# EAGLE design EtchAsketch (EAGLE 9.7.0)
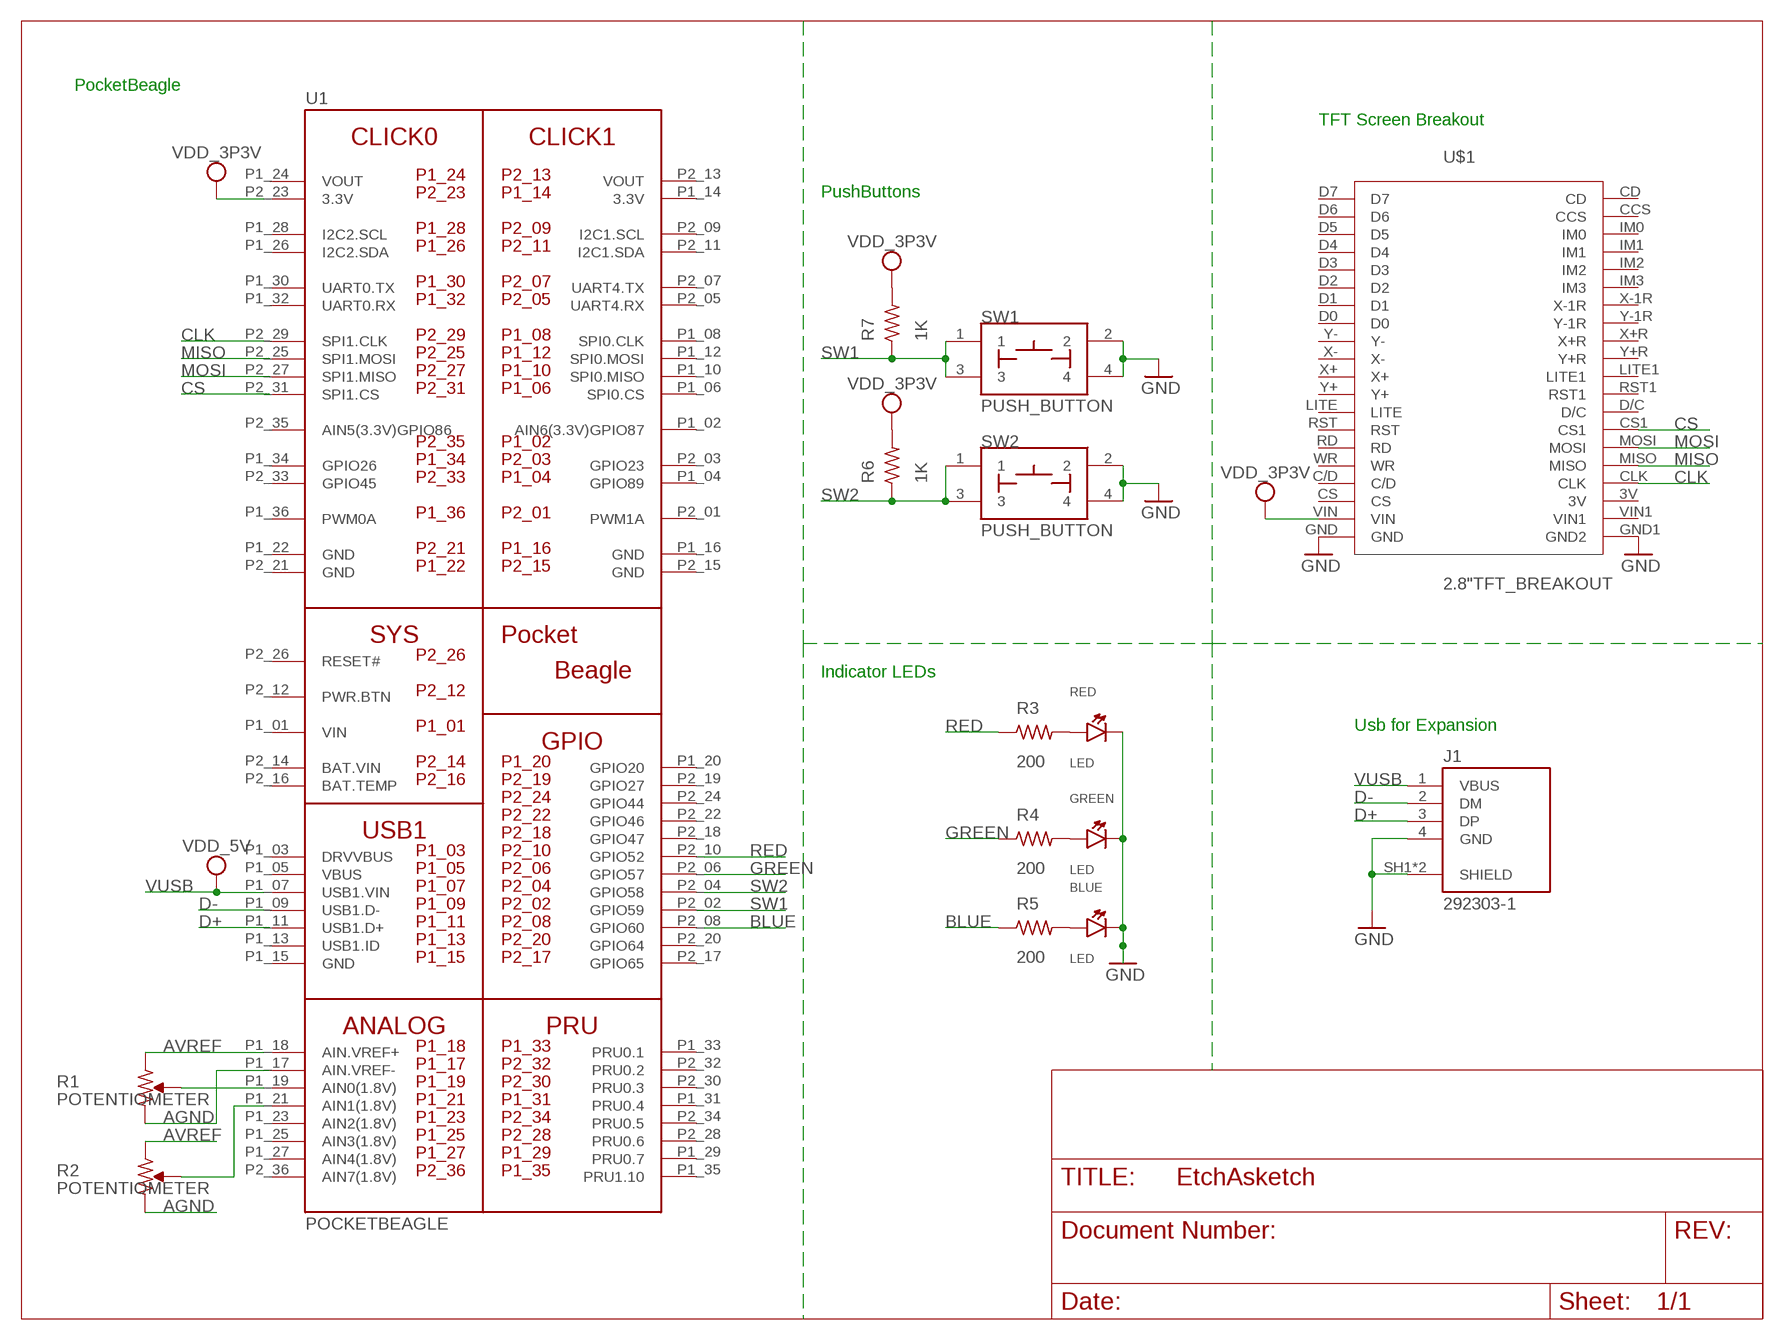
[diagram p0: schematic, sheet 1]

## Parts
BLUE  LED  [EIA-STD]
GREEN  LED  [EIA-STD]
J1  292303-1  [TE_292303-1]
R1  POTENTIOMETER  [POT-PO90S]
R2  POTENTIOMETER  [POT-PO90S]
R3  200  R_R0402  [R0402]
R4  200  R_R0402  [R0402]
R5  200  R_R0402  [R0402]
R6  1K  R_R0402  [R0402]
R7  1K  R_R0402  [R0402]
RED  LED  [EIA-STD]
SW1  PUSH_BUTTON  [BUTTON_12.5MM]
SW2  PUSH_BUTTON  [BUTTON_12.5MM]
U1  POCKETBEAGLE  [POCKETBEAGLE]
U$1  2.8"TFT_BREAKOUT  [2.8"TFTBRTEAKOUT]

## Nets
AGND: R1.CW R2.CW U1.P1_17(AIN.VREF-)
AVREF: R1.CCW R2.CCW U1.P1_18(AIN.VREF+)
BLUE: R5.1 U1.P2_08(GPIO60)
CLK: U1.P2_29(SPI1.CLK) U$1.CLK
CS: U1.P2_31(SPI1.CS) U$1.CS1
D+: J1.3(DP) U1.P1_11(USB1.D+)
D-: J1.2(DM) U1.P1_09(USB1.D-)
GND: BLUE.CATHODE GREEN.CATHODE J1.4(GND) J1.SH1(SHIELD) J1.SH2(SHIELD) RED.CATHODE SW1.2 SW1.4 SW2.2 SW2.4 U$1.GND U$1.GND1(GND2)
GREEN: R4.1 U1.P2_06(GPIO57)
MISO: U1.P2_25(SPI1.MOSI) U$1.MISO
MOSI: U1.P2_27(SPI1.MISO) U$1.MOSI
N$1: R3.2 RED.ANODE
N$2: R1.S U1.P1_19(AIN0(1.8V))
N$3: GREEN.ANODE R4.2
N$4: BLUE.ANODE R5.2
N$6: R2.S U1.P1_21(AIN1(1.8V))
RED: R3.1 U1.P2_10(GPIO52)
SW1: R7.1 SW1.1 SW1.3 U1.P2_02(GPIO59)
SW2: R6.1 SW2.1 SW2.3 U1.P2_04(GPIO58)
VDD_3P3V: R6.2 R7.2 U1.P2_23(3.3V) U$1.VIN
VUSB: J1.1(VBUS) U1.P1_07(USB1.VIN) ; supply symbol labelled VDD_5V
Unconnected: U1.P1_02(AIN6(3.3V)GPIO87) U1.P1_03(DRVVBUS) U1.P1_04(GPIO89) U1.P1_05(VBUS) U1.P1_06(SPI0.CS) U1.P1_08(SPI0.CLK) U1.P1_10(SPI0.MISO) U1.P1_12(SPI0.MOSI) U1.P1_13(USB1.ID) U1.P1_15(GND) U1.P1_20(GPIO20) U1.P1_23(AIN2(1.8V)) U1.P1_25(AIN3(1.8V)) U1.P1_26(I2C2.SDA) U1.P1_27(AIN4(1.8V)) U1.P1_28(I2C2.SCL) U1.P1_29(PRU0.7) U1.P1_30(UART0.TX) U1.P1_31(PRU0.4) U1.P1_32(UART0.RX) U1.P1_33(PRU0.1) U1.P1_34(GPIO26) U1.P1_35(PRU1.10) U1.P1_36(PWM0A) U1.P2_01(PWM1A) U1.P2_03(GPIO23) U1.P2_05(UART4.RX) U1.P2_07(UART4.TX) U1.P2_09(I2C1.SCL) U1.P2_11(I2C1.SDA) U1.P2_12(PWR.BTN) U1.P2_16(BAT.TEMP) U1.P2_17(GPIO65) U1.P2_18(GPIO47) U1.P2_19(GPIO27) U1.P2_20(GPIO64) U1.P2_22(GPIO46) U1.P2_24(GPIO44) U1.P2_26(RESET#) U1.P2_28(PRU0.6) U1.P2_30(PRU0.3) U1.P2_32(PRU0.2) U1.P2_33(GPIO45) U1.P2_34(PRU0.5) U1.P2_35(AIN5(3.3V)GPIO86) U1.P2_36(AIN7(1.8V)) U$1.3V U$1.C/D U$1.CCS U$1.CD U$1.CS U$1.D0 U$1.D1 U$1.D2 U$1.D3 U$1.D4 U$1.D5 U$1.D6 U$1.D7 U$1.D/C U$1.IM0 U$1.IM1 U$1.IM2 U$1.IM3 U$1.LITE U$1.LITE1 U$1.RD U$1.RST U$1.RST1 U$1.VIN1 U$1.WR U$1.X+ U$1.X+R U$1.X- U$1.X-1R U$1.Y+ U$1.Y+R U$1.Y- U$1.Y-1R

## Notes on the sheet
- PocketBeagle
- TFT Screen Breakout
- PushButtons
- Indicator LEDs
- Usb for Expansion

## Power pins joined to a net without a drawn wire
3.3V: U1.P1_14(3.3V)
BAT.VIN: U1.P2_14(BAT.VIN)
GND: U1.P1_16(GND) U1.P1_22(GND) U1.P2_15(GND) U1.P2_21(GND)
VIN: U1.P1_01(VIN)
VOUT: U1.P1_24(VOUT) U1.P2_13(VOUT)

## Library data of the parts
BLUE GREEN RED = EtchASketch:LED: EIA-STD LED, LTST-C191TBKT
J1 = EtchASketch:292303-1: CONN USB RECEPT R/A TYPE A 4POS Check availability <https://pricing.snapeda.com/parts/292303-1/TE%20Connectivity/view-part?ref=eda>; AVAILABILITY: In Stock; CENTERLINE_PITCH: 2 mm[.078 in]; COMMENT: 292303-1; DESCRIPTION: Conn; Data; USB; Recept; 2.0; 4 Pos; 1 Port; Rt Angle; A Ser; Tin over Copper; EU_ROHS_COMPLIANCE: Compliant; MF: TE Connectivity; MP: 292303-1; NUMBER_OF_POSITIONS: 4; PACKAGE: None; PRICE: None; PRODUCT_TYPE: Connector; PURCHASE-URL: https://pricing.snapeda.com/search/part/292303-1/?ref=eda
R1 R2 = EtchASketch:POTENTIOMETER: Potentiometer - Examples: P090S-14T20BR10K (987-1277-ND)
R3-R7 = EtchASketch:R_: RESISTOR, American symbol
SW1 SW2 = EtchASketch:PUSH_BUTTON
U1 = combo_lock:POCKETBEAGLE
U$1 = EtchASketch:2.8"TFT_BREAKOUT

## Board
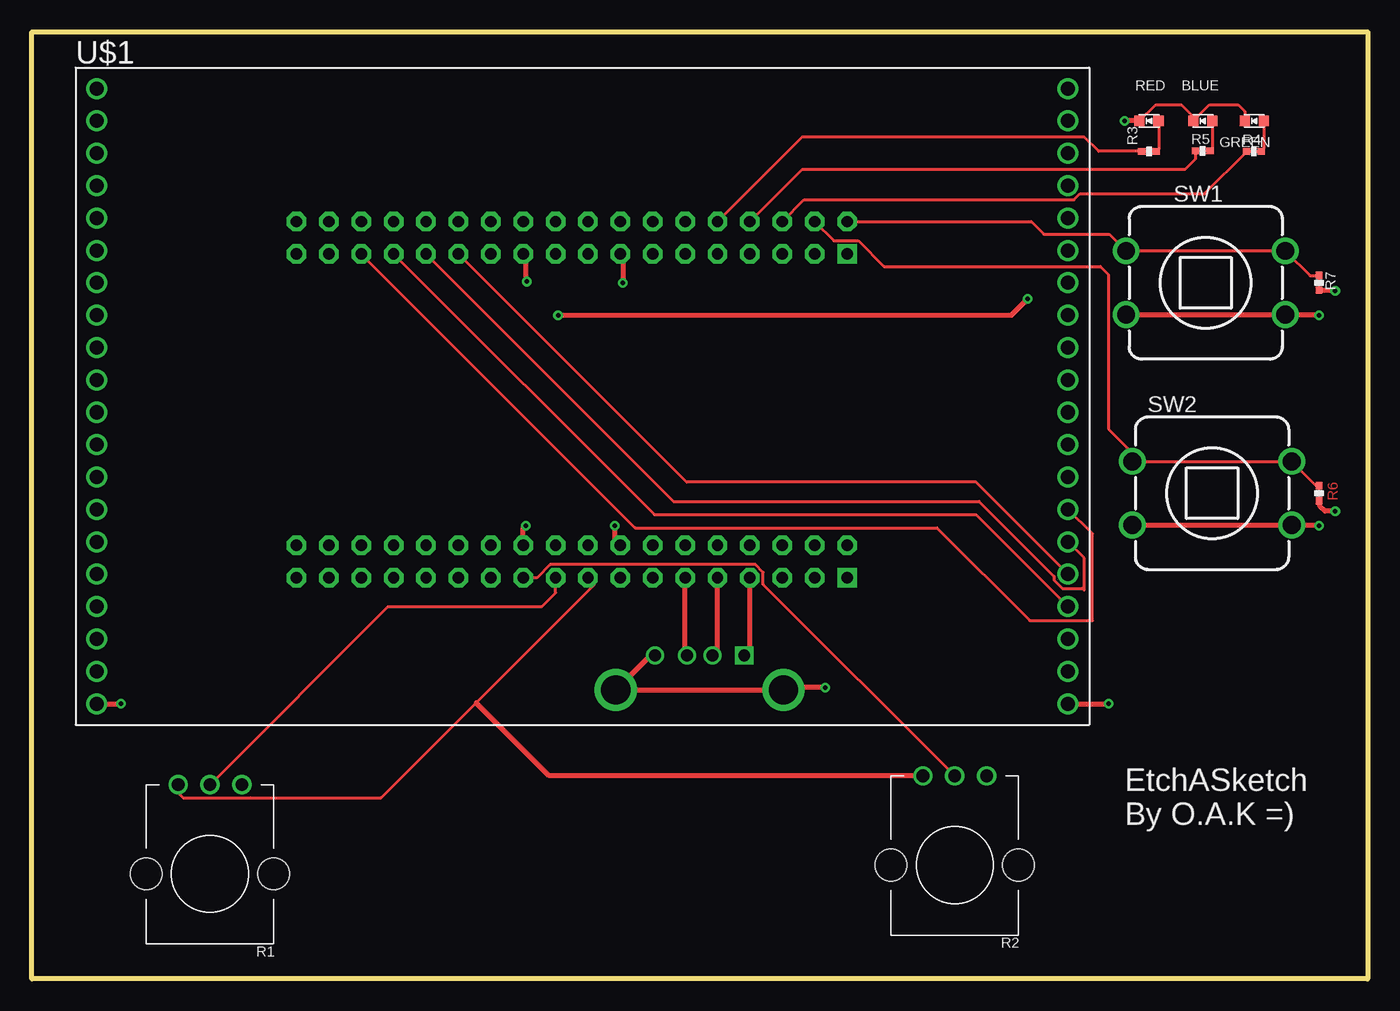
[diagram p1: board, top side]
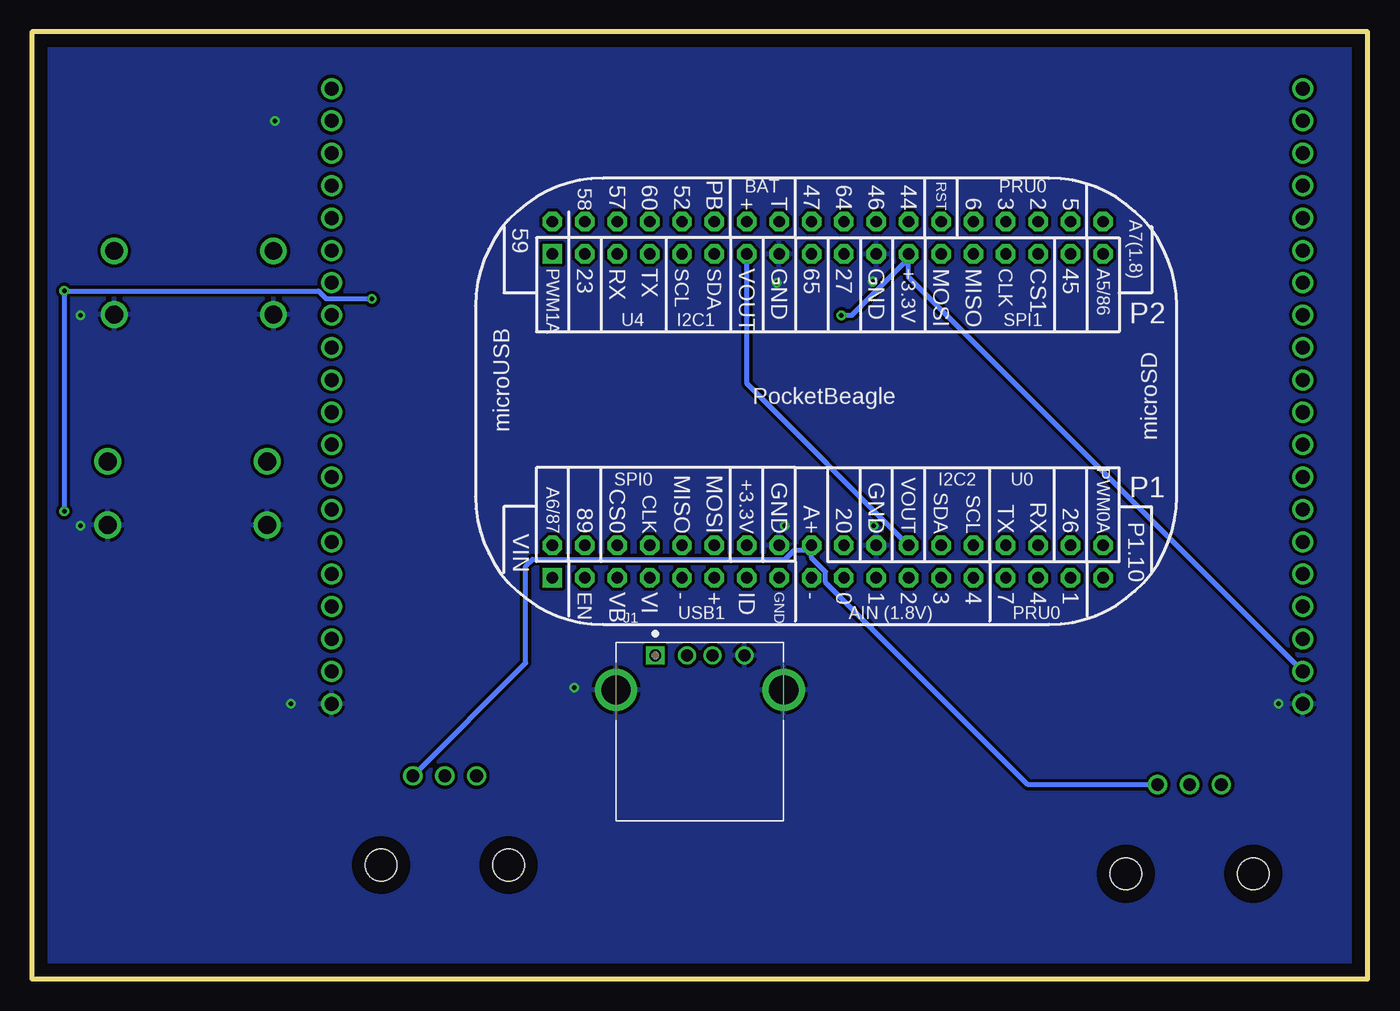
[diagram p2: board, bottom side, seen from below]

Size 104.78 x 74.3 mm. Coordinates in mm from the lower left corner, seen from the top.
Outline: 0,74.3 104.78,74.3 104.78,0 0,0 0,74.3
Copper layers (1*16): Top 0.035mm / dielectric 1.5mm / Bottom 0.035mm
Design rules "Fusion Electronics Design Rules": minimum track width 6mil, minimum drill 0.35mm, track to track 6mil, track to pad 6mil, pad to pad 6mil, via to via 6mil, smd to smd 6mil, copper to edge 40mil, drill to drill 6mil, minimum pad ring 10mil, minimum via ring 8mil, stop-mask expansion 4mil, vias tented up to drill 0mil, thermal gap 10mil

### Footprints (pad centres in the part's own frame; a part is rotated, then mirrored left to right if it is on the bottom)
EIA-STD = smd 0.8 x 0.8: ANODE -0.75,0; CATHODE 0.75,0
TE_292303-1 = drill 0.92 square: 1 0,0 | drill 0.92: 2 2.5,0; 3 4.5,0; 4 7,0 | drill 2.3: SH1 -3.07,-2.71; SH2 10.07,-2.71
POT-PO90S = drill 1: CCW -2.5,0; CW 2.5,0; S 0,0 | hole 2.5: -5,7; 5,7
R0402 = smd 0.61 x 0.508: 1 -0.559,0; 2 0.559,0
BUTTON_12.5MM = drill 1.4: 1 -6.25,2.5; 2 -6.25,-2.5; 3 6.25,2.5; 4 6.25,-2.5
POCKETBEAGLE = drill 0.889 pad 1.524 square: P1_01 5.91,3.53; P2_01 5.91,28.93 | drill 0.889 pad 1.524 octagon: P1_02 5.91,6.07; P1_03 8.45,3.53; P1_04 8.45,6.07; P1_05 10.99,3.53; P1_06 10.99,6.07; P1_07 13.53,3.53; P1_08 13.53,6.07; P1_09 16.07,3.53; P1_10 16.07,6.07; P1_11 18.61,3.53; P1_12 18.61,6.07; P1_13 21.15,3.53; P1_14 21.15,6.07; P1_15 23.69,3.53; P1_16 23.69,6.07; P1_17 26.23,3.53; P1_18 26.23,6.07; P1_19 28.77,3.53; P1_20 28.77,6.07; P1_21 31.31,3.53; P1_22 31.31,6.07; P1_23 33.85,3.53; P1_24 33.85,6.07; P1_25 36.39,3.53; P1_26 36.39,6.07; P1_27 38.93,3.53; P1_28 38.93,6.07; P1_29 41.47,3.53; P1_30 41.47,6.07; P1_31 44.01,3.53; P1_32 44.01,6.07; P1_33 46.55,3.53; P1_34 46.55,6.07; P1_35 49.09,3.53; P1_36 49.09,6.07; P2_02 5.91,31.47; P2_03 8.45,28.93; P2_04 8.45,31.47; P2_05 10.99,28.93; P2_06 10.99,31.47; P2_07 13.53,28.93; P2_08 13.53,31.47; P2_09 16.07,28.93; P2_10 16.07,31.47; P2_11 18.61,28.93; P2_12 18.61,31.47; P2_13 21.15,28.93; P2_14 21.15,31.47; P2_15 23.69,28.93; P2_16 23.69,31.47; P2_17 26.23,28.93; P2_18 26.23,31.47; P2_19 28.77,28.93; P2_20 28.77,31.47; P2_21 31.31,28.93; P2_22 31.31,31.47; P2_23 33.85,28.93; P2_24 33.85,31.47; P2_25 36.39,28.93; P2_26 36.39,31.47; P2_27 38.93,28.93; P2_28 38.93,31.47; P2_29 41.47,28.93; P2_30 41.47,31.47; P2_31 44.01,28.93; P2_32 44.01,31.47; P2_33 46.55,28.93; P2_34 46.55,31.47; P2_35 49.09,28.93; P2_36 49.09,31.47
2.8"TFTBRTEAKOUT = drill 1.1: 3V 78.74,-44.45; C/D 2.54,-41.91; CCS 78.74,-3.81; CD 78.74,-1.27; CLK 78.74,-41.91; CS 2.54,-44.45; CS1 78.74,-34.29; D0 2.54,-19.05; D1 2.54,-16.51; D2 2.54,-13.97; D3 2.54,-11.43; D4 2.54,-8.89; D5 2.54,-6.35; D6 2.54,-3.81; D7 2.54,-1.27; D/C 78.74,-31.75; GND 2.54,-49.53; GND1 78.74,-49.53; IM0 78.74,-6.35; IM1 78.74,-8.89; IM2 78.74,-11.43; IM3 78.74,-13.97; LITE 2.54,-31.75; LITE1 78.74,-26.67; MISO 78.74,-39.37; MOSI 78.74,-36.83; RD 2.54,-36.83; RST 2.54,-34.29; RST1 78.74,-29.21; VIN 2.54,-46.99; VIN1 78.74,-46.99; WR 2.54,-39.37; X+ 2.54,-29.21; X+R 78.74,-21.59; X- 2.54,-24.13; X-1R 78.74,-16.51; Y+ 2.54,-26.67; Y+R 78.74,-24.13; Y- 2.54,-21.59; Y-1R 78.74,-19.05

### Placement (x,y rotation side)
BLUE  91.85,67.31 180 top
GREEN  95.88,67.31 180 top
J1  55.88,25.38 0 bottom
R1  13.97,15.24 180 top
R2  72.39,15.93 180 top
R3  87.63,64.92 0 top
R4  95.85,64.91 0 top
R5  91.83,64.95 0 top
R6  100.97,38.1 270 top
R7  100.97,54.61 270 top
RED  87.63,67.31 180 top
SW1  92.07,54.61 0 top
SW2  92.57,38.1 0 top
U1  69.85,27.94 0 bottom
U$1  2.54,71.12 0 top

### Tracks (layer width: path | path; a pad name or v marks a point on that pad's centre or on a via)
AGND
  Top 0.254: U1.P1_17 44.13,30.96 34.84,21.67 27.38,14.21 17.15,14.21 11.87,14.21 11.47,14.6 R1.CW
  Top 0.381: R2.CW 40.58,15.93 34.84,21.67
AVREF
  Top 0.254: 43.62,33.46 U1.P1_18
  Bottom 0.381: R1.CCW 26.64,15.24 42.52,31.11 42.52,31.93 43.62,33.03 43.62,33.66 | 43.62,33.66 U1.P1_18 | R2.CCW 66.04,24.78 66.04,32.39 65.52,32.91 45.7,32.91 44.95,33.66 43.62,33.66
BLUE
  Top 0.254: U1.P2_08 60.41,63.5 90.45,63.5 91.27,64.32 R5.1 91.27,64.94
CLK
  Top 0.254: U$1.CLK 74.07,36.42 48.83,36.42 U1.P2_29
CS
  Top 0.254: U$1.CS1 83.19,34.92 83.19,28.11 78.28,28.11 71.01,35.38 47.33,35.38 U1.P2_31
D+
  Top 0.381: U1.P1_11 51.24,25.38 J1.3
D-
  Top 0.381: U1.P1_09 53.78,25.38 J1.2
GND  (via drill 0.35 pad 0.61)
  Top 0.254: RED.CATHODE 88.15,68.58 90.17,68.58 91.1,67.65 BLUE.CATHODE 92.37,68.58 94.62,68.58 95.13,68.06 GREEN.CATHODE
  Top 0.381: J1.4 48.52,25.38 J1.SH2 J1.SH1 59.14,22.86 v62.23,22.86 | U$1.GND1 v84.46,21.59 | SW2.2 SW2.4 100.93,35.6 v100.97,35.56 | SW1.2 SW1.4 100.93,52.11 v100.97,52.07 | RED.CATHODE v85.72,67.31 | U1.P2_21 38.74,56.67 38.74,54.8 v38.83,54.7 | U1.P2_15 46.35,56.67 v46.35,54.61 | U1.P1_16 45.72,34.45 v45.72,35.56 | U1.P1_22 38.54,35.36 v38.74,35.56 | U$1.GND v6.98,21.59
  pour Bottom (isolate 0.254): -2.35,76.64 -2.35,76.39 -1.87,76.39 -1.8,76.36 -1.74,76.31 -1.71,76.24 -1.71,-4.89 112.84,-4.89 112.84,76.64
GREEN
  Top 0.254: U1.P2_06 60.58,61.13 81.74,61.13 82.21,61.59 91.97,61.59 R4.1
MISO
  Top 0.254: U$1.MISO 74.07,38.96 51.37,38.96 U1.P2_25
MOSI
  Top 0.254: 80.65,34.29 U$1.MOSI 82.55,33.02 82.55,30.48 82.38,30.65 80.82,30.65 80.18,31.29 80.18,31.58 74.29,37.47 50.32,37.47 U1.P2_27
N$1
  Top 0.254: RED.ANODE 88.38,65.11 R3.2
N$2
  Top 0.254: R1.S 27.94,29.21 40.01,29.21 41.08,30.29 U1.P1_19
N$3
  Top 0.254: GREEN.ANODE 96.63,65.14 R4.2
N$4
  Top 0.254: BLUE.ANODE 92.6,65.17 R5.2
N$6
  Top 0.254: R2.S 57.36,30.96 57.36,31.9 56.75,32.51 40.65,32.51 39.61,31.47 U1.P1_21
RED
  Top 0.254: R3.1 83.67,64.92 82.55,66.04 60.41,66.04 U1.P2_10
SW1
  Top 0.254: R7.1 100.27,55.17 SW1.3 SW1.1 84.52,58.42 79.38,58.42 78.38,59.41 U1.P2_02
SW2
  Top 0.254: SW2.1 87,40.6 | 87,40.6 SW2.3 100.76,38.66 R6.1 | U1.P2_04 62.9,57.91 64.82,57.91 66.85,55.88 83.82,55.88 84.46,55.24 84.46,43.14 87,40.6
VDD_3P3V  (via drill 0.35 pad 0.61)
  Top 0.381: R7.2 102.16,54.05 v102.24,53.97 | v41.27,52.07 76.84,52.07 v78.1,53.34 | R6.2 101.03,37.48 101.03,37.08 101.42,36.69 v102.24,36.69
  Bottom 0.381: U$1.VIN 36,55.05 36,56.52 | 36,56.52 U1.P2_23 | v102.24,36.69 v102.24,53.97 82.3,53.97 81.66,53.34 v78.1,53.34 | v41.27,52.07 40.45,52.07 36,56.52
VOUT
  Bottom 0.381: U1.P2_13 48.7,46.71 U1.P1_24
VUSB
  Top 0.381: U1.P1_07 56.32,25.82 J1.1

### Text on the board
tPlace: EtchASketch / By O.A.K =)